# Altium schematic sheet Conectores Finales.SchDoc
size A4
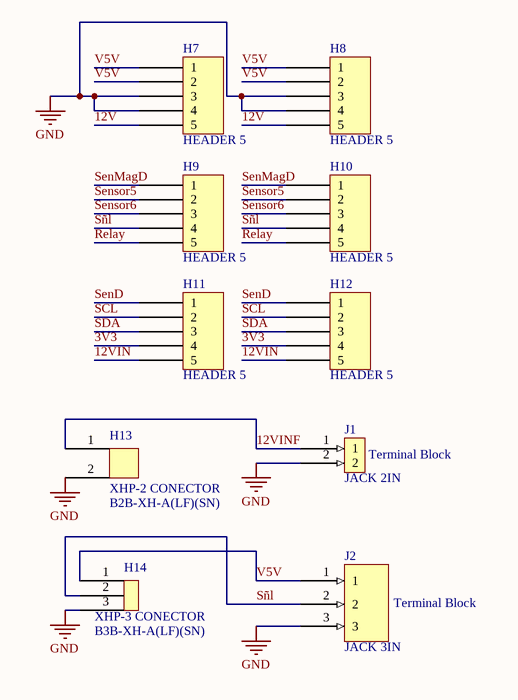
[diagram p0: Conectores Finales.SchDoc]

## Parts
H7  HEADER 5  [HEADER5]
H8  HEADER 5  [HEADER5]
H9  HEADER 5  [HEADER5]
H10  HEADER 5  [HEADER5]
H11  HEADER 5  [HEADER5]
H12  HEADER 5  [HEADER5]
H13  XHP-2 CONECTOR  [CONECTOR 2 PINES]
H14  XHP-3 CONECTOR  [CONECTOR XHP-3]
J1  JACK 2IN  [Terminal Blocks 2in]
J2  JACK 3IN  [Terminal Blocks 3in]

## Nets
GND: H7.3 H7.4 H8.3 H8.4 H13.2 H14.3 J1.2 J2.3
3V3: H11.4 H12.4
12V: H7.5 H8.5
12VIN: H11.5 H12.5
12VINF: H13.1 J1.1
Relay: H9.5 H10.5
SCL: H11.2 H12.2
SDA: H11.3 H12.3
SenD: H11.1 H12.1
SenMagD: H9.1 H10.1
Sensor5: H9.2 H10.2
Sensor6: H9.3 H10.3
Sñl: H9.4 H10.4 H14.2 J2.2
V5V: H7.1 H7.2 H8.1 H8.2 H14.1 J2.1

## Notes on the sheet
- (in symbol JACK 2IN) Terminal Block
- (in symbol JACK 3IN) Terminal Block

## Library data of the parts
H13 = B2B-XH-A(LF)(SN): CONECTOR JST-XH 2 PINES; SUPPLIER NUMBER PART: B2B-XH-A(LF)(SN)
H14 = B3B-XH-A(LF)(SN): CONECTOR JST-XH 3 PINES; SUPPLIER NUMBER PART: B3B-XH-A(LF)(SN)
J1 = JACK 2IN: Pluggable Terminal Blocks WR-TBL Mod312 5.08mm 2Pin Opn Hztl PCBHdr; Manufacturer: Wurth Electronics; Manufacturer Part Number: 691312510002; Current Rating: 20 A; Mounting Angle: Horizontal; Mounting Method: PCB; Number of Positions: 2 Position; Voltage Rating: 300 V; Supplier 1: Mouser; RoHS: RoHS Compliant; Category: Pluggable Terminal Blocks; Stock 1: 413; Pricing 1: 1=0.528, 10=0.499, 50=0.475, 100=0.453, 500=0.429, 1000=0.416 (AUD); Color: Green; Connection Method: -; Contact Plating: Tin; Housing Material: Polybutylene Terephthalate (PBT); Packaging: Bulk; Product: Headers; Series: WR-TBL; Termination Style: Through Hole; Brand: Wurth Electronics; Contact Material: Brass; Flammability Rating: UL 94 V-0; Pitch: 5.08 mm; Wire Gauge Range: -; Wire Orientation: Horizontal; RoHS - Mouser: Y; Minimum Order Quantity: 1; Reeling: False; ComponentLink1URL: http://www.mouser.com/ds/2/445/6913125100xx-537850.pdf; ComponentLink1Description: http://www.mouser.com/ds/2/445/6913125100xx-537850.pdf; Supplier Part Number 1: 710-691312510002
J2 = JACK 3IN: Pluggable Terminal Blocks WR-TBL Mod312 5.08mm 3Pin Opn Hztl PCBHdr; Manufacturer: Wurth Electronics; Manufacturer Part Number: 691312510003; Current Rating: 20 A; Mounting Angle: Horizontal; Mounting Method: PCB; Number of Positions: 3 Position; Voltage Rating: 300 V; Supplier 1: Mouser; RoHS: RoHS Compliant; Category: Pluggable Terminal Blocks; Stock 1: 425; Pricing 1: 1=0.784, 10=0.750, 50=0.714, 100=0.677, 500=0.630, 1000=0.624 (AUD); Color: Green; Connection Method: -; Contact Plating: Tin; Housing Material: Polybutylene Terephthalate (PBT); Packaging: Bulk; Product: Headers; Series: WR-TBL; Termination Style: Through Hole; Brand: Wurth Electronics; Contact Material: Brass; Flammability Rating: UL 94 V-0; Pitch: 5.08 mm; Wire Gauge Range: -; Wire Orientation: Horizontal; RoHS - Mouser: Y; Minimum Order Quantity: 1; Reeling: False; ComponentLink1URL: http://www.mouser.com/ds/2/445/6913125100xx-537850.pdf; ComponentLink1Description: http://www.mouser.com/ds/2/445/6913125100xx-537850.pdf; Supplier Part Number 1: 710-691312510003